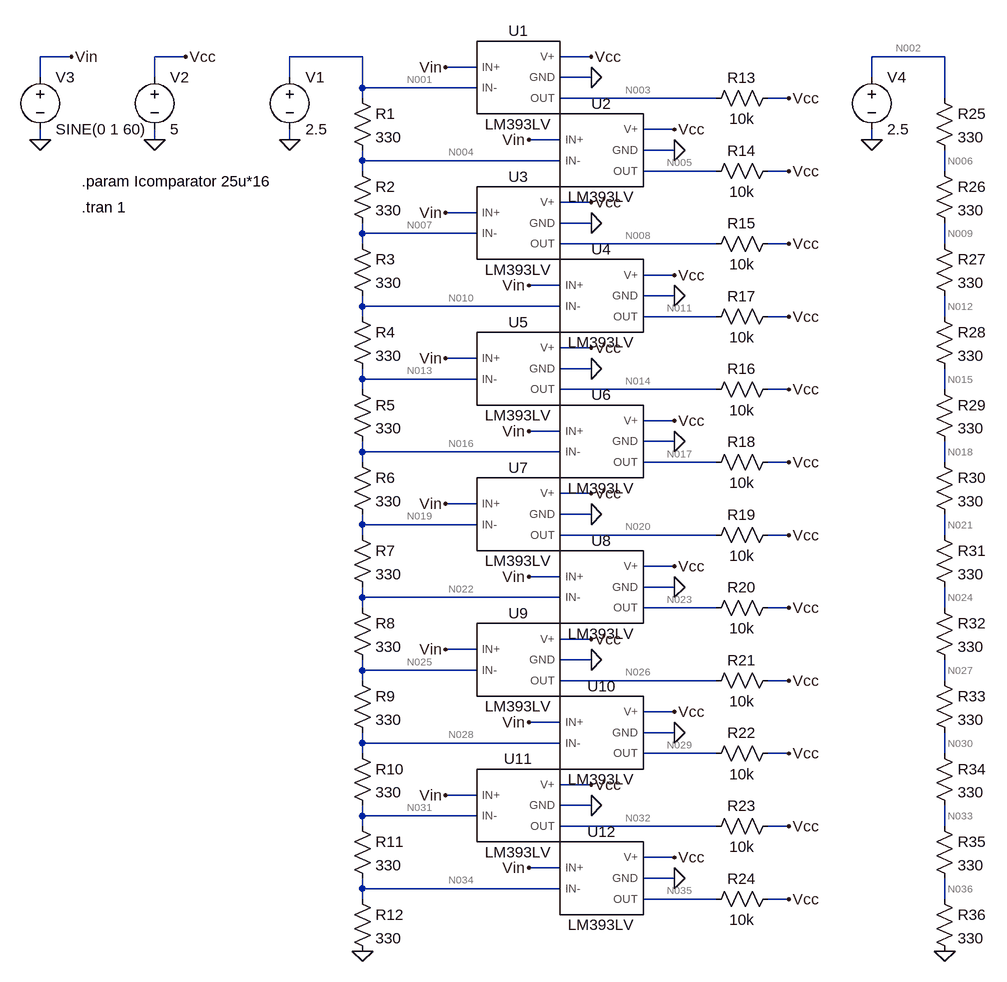
[diagram p0: schematic Draft1.asc]
Draft1.asc, the LTspice schematic file:
Version 4
SHEET 1 1140 1428
WIRE -272 32 -320 32
WIRE -96 32 -144 32
WIRE 176 32 64 32
WIRE 528 32 480 32
WIRE 1072 32 960 32
WIRE 352 48 304 48
WIRE -320 64 -320 32
WIRE -144 64 -144 32
WIRE 64 64 64 32
WIRE 528 64 480 64
WIRE 960 64 960 32
WIRE 176 80 176 32
WIRE 352 80 176 80
WIRE 176 96 176 80
WIRE 720 96 480 96
WIRE 832 96 800 96
WIRE 1072 96 1072 32
WIRE 656 144 608 144
WIRE -320 160 -320 144
WIRE -144 160 -144 144
WIRE 64 160 64 144
WIRE 480 160 432 160
WIRE 960 160 960 144
WIRE 656 176 608 176
WIRE 176 192 176 176
WIRE 480 192 176 192
WIRE 176 208 176 192
WIRE 720 208 608 208
WIRE 832 208 800 208
WIRE 1072 208 1072 176
WIRE 528 256 480 256
WIRE 352 272 304 272
WIRE 528 288 480 288
WIRE 176 304 176 288
WIRE 352 304 176 304
WIRE 176 320 176 304
WIRE 720 320 480 320
WIRE 832 320 800 320
WIRE 1072 320 1072 288
WIRE 656 368 608 368
WIRE 480 384 432 384
WIRE 656 400 608 400
WIRE 176 416 176 400
WIRE 480 416 176 416
WIRE 176 432 176 416
WIRE 720 432 608 432
WIRE 832 432 800 432
WIRE 1072 432 1072 400
WIRE 528 480 480 480
WIRE 352 496 304 496
WIRE 528 512 480 512
WIRE 176 528 176 512
WIRE 352 528 176 528
WIRE 176 544 176 528
WIRE 720 544 480 544
WIRE 832 544 800 544
WIRE 1072 544 1072 512
WIRE 656 592 608 592
WIRE 480 608 432 608
WIRE 656 624 608 624
WIRE 176 640 176 624
WIRE 480 640 176 640
WIRE 176 656 176 640
WIRE 720 656 608 656
WIRE 832 656 800 656
WIRE 1072 656 1072 624
WIRE 528 704 480 704
WIRE 352 720 304 720
WIRE 528 736 480 736
WIRE 176 752 176 736
WIRE 352 752 176 752
WIRE 176 768 176 752
WIRE 720 768 480 768
WIRE 832 768 800 768
WIRE 1072 768 1072 736
WIRE 656 816 608 816
WIRE 480 832 432 832
WIRE 656 848 608 848
WIRE 176 864 176 848
WIRE 480 864 176 864
WIRE 176 880 176 864
WIRE 720 880 608 880
WIRE 832 880 800 880
WIRE 1072 880 1072 848
WIRE 528 928 480 928
WIRE 352 944 304 944
WIRE 528 960 480 960
WIRE 176 976 176 960
WIRE 352 976 176 976
WIRE 176 992 176 976
WIRE 720 992 480 992
WIRE 832 992 800 992
WIRE 1072 992 1072 960
WIRE 656 1040 608 1040
WIRE 480 1056 432 1056
WIRE 656 1072 608 1072
WIRE 176 1088 176 1072
WIRE 480 1088 176 1088
WIRE 176 1104 176 1088
WIRE 720 1104 608 1104
WIRE 832 1104 800 1104
WIRE 1072 1104 1072 1072
WIRE 528 1152 480 1152
WIRE 352 1168 304 1168
WIRE 528 1184 480 1184
WIRE 176 1200 176 1184
WIRE 352 1200 176 1200
WIRE 176 1216 176 1200
WIRE 720 1216 480 1216
WIRE 832 1216 800 1216
WIRE 1072 1216 1072 1184
WIRE 656 1264 608 1264
WIRE 480 1280 432 1280
WIRE 656 1296 608 1296
WIRE 176 1312 176 1296
WIRE 480 1312 176 1312
WIRE 176 1328 176 1312
WIRE 720 1328 608 1328
WIRE 832 1328 800 1328
WIRE 1072 1328 1072 1296
FLAG 176 1408 0
FLAG 64 160 0
FLAG -96 32 Vcc
FLAG -144 160 0
FLAG 304 48 Vin
FLAG 432 160 Vin
FLAG 304 272 Vin
FLAG 432 384 Vin
FLAG 432 608 Vin
FLAG 432 832 Vin
FLAG 304 496 Vin
FLAG 304 720 Vin
FLAG 304 944 Vin
FLAG 304 1168 Vin
FLAG 432 1056 Vin
FLAG 432 1280 Vin
FLAG -320 160 0
FLAG -272 32 Vin
FLAG 528 32 Vcc
FLAG 528 64 0
FLAG 528 256 Vcc
FLAG 528 288 0
FLAG 656 144 Vcc
FLAG 656 176 0
FLAG 656 368 Vcc
FLAG 656 400 0
FLAG 528 480 Vcc
FLAG 528 512 0
FLAG 528 704 Vcc
FLAG 528 736 0
FLAG 528 928 Vcc
FLAG 528 960 0
FLAG 528 1152 Vcc
FLAG 528 1184 0
FLAG 656 592 Vcc
FLAG 656 624 0
FLAG 656 816 Vcc
FLAG 656 848 0
FLAG 656 1040 Vcc
FLAG 656 1072 0
FLAG 656 1264 Vcc
FLAG 656 1296 0
FLAG 832 96 Vcc
FLAG 832 208 Vcc
FLAG 832 320 Vcc
FLAG 832 544 Vcc
FLAG 832 432 Vcc
FLAG 832 656 Vcc
FLAG 832 768 Vcc
FLAG 832 880 Vcc
FLAG 832 992 Vcc
FLAG 832 1104 Vcc
FLAG 832 1216 Vcc
FLAG 832 1328 Vcc
FLAG 1072 1408 0
FLAG 960 160 0
SYMBOL res 160 80 R0
SYMATTR InstName R1
SYMATTR Value 330
SYMBOL res 160 192 R0
SYMATTR InstName R2
SYMATTR Value 330
SYMBOL res 160 304 R0
SYMATTR InstName R3
SYMATTR Value 330
SYMBOL res 160 416 R0
SYMATTR InstName R4
SYMATTR Value 330
SYMBOL res 160 528 R0
SYMATTR InstName R5
SYMATTR Value 330
SYMBOL res 160 640 R0
SYMATTR InstName R6
SYMATTR Value 330
SYMBOL res 160 752 R0
SYMATTR InstName R7
SYMATTR Value 330
SYMBOL res 160 864 R0
SYMATTR InstName R8
SYMATTR Value 330
SYMBOL res 160 976 R0
SYMATTR InstName R9
SYMATTR Value 330
SYMBOL res 160 1088 R0
SYMATTR InstName R10
SYMATTR Value 330
SYMBOL res 160 1200 R0
SYMATTR InstName R11
SYMATTR Value 330
SYMBOL res 160 1312 R0
SYMATTR InstName R12
SYMATTR Value 330
SYMBOL voltage 64 48 R0
SYMATTR InstName V1
SYMATTR Value 2.5
SYMBOL LM393LV 416 64 R0
SYMATTR InstName U1
SYMBOL LM393LV 544 176 R0
SYMATTR InstName U2
SYMBOL LM393LV 416 288 R0
SYMATTR InstName U3
SYMBOL LM393LV 544 400 R0
SYMATTR InstName U4
SYMBOL LM393LV 416 512 R0
SYMATTR InstName U5
SYMBOL LM393LV 544 624 R0
SYMATTR InstName U6
SYMBOL LM393LV 416 736 R0
SYMATTR InstName U7
SYMBOL LM393LV 544 848 R0
SYMATTR InstName U8
SYMBOL LM393LV 416 960 R0
SYMATTR InstName U9
SYMBOL LM393LV 544 1072 R0
SYMATTR InstName U10
SYMBOL LM393LV 416 1184 R0
SYMATTR InstName U11
SYMBOL LM393LV 544 1296 R0
SYMATTR InstName U12
SYMBOL voltage -144 48 R0
SYMATTR InstName V2
SYMATTR Value 5
SYMBOL voltage -320 48 R0
WINDOW 123 0 0 Left 0
WINDOW 39 0 0 Left 0
SYMATTR InstName V3
SYMATTR Value SINE(0 1 60)
SYMBOL res 816 80 R90
WINDOW 0 0 56 VBottom 2
WINDOW 3 32 56 VTop 2
SYMATTR InstName R13
SYMATTR Value 10k
SYMBOL res 816 192 R90
WINDOW 0 0 56 VBottom 2
WINDOW 3 32 56 VTop 2
SYMATTR InstName R14
SYMATTR Value 10k
SYMBOL res 816 304 R90
WINDOW 0 0 56 VBottom 2
WINDOW 3 32 56 VTop 2
SYMATTR InstName R15
SYMATTR Value 10k
SYMBOL res 816 528 R90
WINDOW 0 0 56 VBottom 2
WINDOW 3 32 56 VTop 2
SYMATTR InstName R16
SYMATTR Value 10k
SYMBOL res 816 416 R90
WINDOW 0 0 56 VBottom 2
WINDOW 3 32 56 VTop 2
SYMATTR InstName R17
SYMATTR Value 10k
SYMBOL res 816 640 R90
WINDOW 0 0 56 VBottom 2
WINDOW 3 32 56 VTop 2
SYMATTR InstName R18
SYMATTR Value 10k
SYMBOL res 816 752 R90
WINDOW 0 0 56 VBottom 2
WINDOW 3 32 56 VTop 2
SYMATTR InstName R19
SYMATTR Value 10k
SYMBOL res 816 864 R90
WINDOW 0 0 56 VBottom 2
WINDOW 3 32 56 VTop 2
SYMATTR InstName R20
SYMATTR Value 10k
SYMBOL res 816 976 R90
WINDOW 0 0 56 VBottom 2
WINDOW 3 32 56 VTop 2
SYMATTR InstName R21
SYMATTR Value 10k
SYMBOL res 816 1088 R90
WINDOW 0 0 56 VBottom 2
WINDOW 3 32 56 VTop 2
SYMATTR InstName R22
SYMATTR Value 10k
SYMBOL res 816 1200 R90
WINDOW 0 0 56 VBottom 2
WINDOW 3 32 56 VTop 2
SYMATTR InstName R23
SYMATTR Value 10k
SYMBOL res 816 1312 R90
WINDOW 0 0 56 VBottom 2
WINDOW 3 32 56 VTop 2
SYMATTR InstName R24
SYMATTR Value 10k
SYMBOL res 1056 80 R0
SYMATTR InstName R25
SYMATTR Value 330
SYMBOL res 1056 192 R0
SYMATTR InstName R26
SYMATTR Value 330
SYMBOL res 1056 304 R0
SYMATTR InstName R27
SYMATTR Value 330
SYMBOL res 1056 416 R0
SYMATTR InstName R28
SYMATTR Value 330
SYMBOL res 1056 528 R0
SYMATTR InstName R29
SYMATTR Value 330
SYMBOL res 1056 640 R0
SYMATTR InstName R30
SYMATTR Value 330
SYMBOL res 1056 752 R0
SYMATTR InstName R31
SYMATTR Value 330
SYMBOL res 1056 864 R0
SYMATTR InstName R32
SYMATTR Value 330
SYMBOL res 1056 976 R0
SYMATTR InstName R33
SYMATTR Value 330
SYMBOL res 1056 1088 R0
SYMATTR InstName R34
SYMATTR Value 330
SYMBOL res 1056 1200 R0
SYMATTR InstName R35
SYMATTR Value 330
SYMBOL res 1056 1312 R0
SYMATTR InstName R36
SYMATTR Value 330
SYMBOL voltage 960 48 R0
SYMATTR InstName V4
SYMATTR Value 2.5
TEXT -256 224 Left 2 !.param Icomparator 25u*16
TEXT -256 264 Left 2 !.tran 1

The netlist it stands for:
* Draft1.asc
R1 N001 N004 330
R2 N004 N007 330
R3 N007 N010 330
R4 N010 N013 330
R5 N013 N016 330
R6 N016 N019 330
R7 N019 N022 330
R8 N022 N025 330
R9 N025 N028 330
R10 N028 N031 330
R11 N031 N034 330
R12 N034 0 330
V1 N001 0 2.5
XU1 Vin N001 Vcc 0 N003 LM393LV  ; pins IN+ IN- V+ GND OUT
XU2 Vin N004 Vcc 0 N005 LM393LV  ; pins IN+ IN- V+ GND OUT
XU3 Vin N007 Vcc 0 N008 LM393LV  ; pins IN+ IN- V+ GND OUT
XU4 Vin N010 Vcc 0 N011 LM393LV  ; pins IN+ IN- V+ GND OUT
XU5 Vin N013 Vcc 0 N014 LM393LV  ; pins IN+ IN- V+ GND OUT
XU6 Vin N016 Vcc 0 N017 LM393LV  ; pins IN+ IN- V+ GND OUT
XU7 Vin N019 Vcc 0 N020 LM393LV  ; pins IN+ IN- V+ GND OUT
XU8 Vin N022 Vcc 0 N023 LM393LV  ; pins IN+ IN- V+ GND OUT
XU9 Vin N025 Vcc 0 N026 LM393LV  ; pins IN+ IN- V+ GND OUT
XU10 Vin N028 Vcc 0 N029 LM393LV  ; pins IN+ IN- V+ GND OUT
XU11 Vin N031 Vcc 0 N032 LM393LV  ; pins IN+ IN- V+ GND OUT
XU12 Vin N034 Vcc 0 N035 LM393LV  ; pins IN+ IN- V+ GND OUT
V2 Vcc 0 5
V3 Vin 0 SINE(0 1 60)
R13 Vcc N003 10k
R14 Vcc N005 10k
R15 Vcc N008 10k
R16 Vcc N014 10k
R17 Vcc N011 10k
R18 Vcc N017 10k
R19 Vcc N020 10k
R20 Vcc N023 10k
R21 Vcc N026 10k
R22 Vcc N029 10k
R23 Vcc N032 10k
R24 Vcc N035 10k
R25 N002 N006 330
R26 N006 N009 330
R27 N009 N012 330
R28 N012 N015 330
R29 N015 N018 330
R30 N018 N021 330
R31 N021 N024 330
R32 N024 N027 330
R33 N027 N030 330
R34 N030 N033 330
R35 N033 N036 330
R36 N036 0 330
V4 N002 0 2.5
.param Icomparator 25u*16
.tran 1
.lib C:\Users\alfaw\Documents\LTspice\Spectrum Analyzer\snom697a\lm393lv.lib
.backanno
.end

* Results of the author's LTspice run, read from the files saved beside the schematic
* Operating Point, zero values left out:
*   V(n001) = 2.5 V
*   V(n004) = 2.292 V
*   V(n007) = 2.083 V
*   V(n010) = 1.875 V
*   V(n013) = 1.667 V
*   V(n016) = 1.458 V
*   V(n019) = 1.25 V
*   V(n022) = 1.042 V
*   V(n025) = 833.3 mV
*   V(n028) = 625 mV
*   V(n031) = 416.7 mV
*   V(n034) = 208.3 mV
*   V(vcc) = 5 V
*   V(n003) = 30.81 mV
*   V(n005) = 30.81 mV
*   V(n008) = 30.81 mV
*   V(n011) = 30.81 mV
*   V(n014) = 30.81 mV
*   V(n017) = 30.81 mV
*   V(n020) = 30.81 mV
*   V(n023) = 30.81 mV
*   V(n026) = 30.81 mV
*   V(n029) = 30.81 mV
*   V(n032) = 30.81 mV
*   V(n035) = 30.81 mV
*   V(n002) = 2.5 V
*   V(n006) = 2.292 V
*   V(n009) = 2.083 V
*   V(n012) = 1.875 V
*   V(n015) = 1.667 V
*   V(n018) = 1.458 V
*   V(n021) = 1.25 V
*   V(n024) = 1.042 V
*   V(n027) = 833.3 mV
*   V(n030) = 625 mV
*   V(n033) = 416.7 mV
*   V(n036) = 208.3 mV
*   I(R1) = 631.3 µA
*   I(R2) = 631.3 µA
*   I(R3) = 631.3 µA
*   I(R4) = 631.3 µA
*   I(R5) = 631.3 µA
*   I(R6) = 631.3 µA
*   I(R7) = 631.3 µA
*   I(R8) = 631.3 µA
*   I(R9) = 631.3 µA
*   I(R10) = 631.3 µA
*   I(R11) = 631.3 µA
*   I(R12) = 631.3 µA
*   I(R13) = 496.9 µA
*   I(R14) = 496.9 µA
*   I(R15) = 496.9 µA
*   I(R16) = 496.9 µA
*   I(R17) = 496.9 µA
*   I(R18) = 496.9 µA
*   I(R19) = 496.9 µA
*   I(R20) = 496.9 µA
*   I(R21) = 496.9 µA
*   I(R22) = 496.9 µA
*   I(R23) = 496.9 µA
*   I(R24) = 496.9 µA
*   I(R25) = 631.3 µA
*   I(R26) = 631.3 µA
*   I(R27) = 631.3 µA
*   I(R28) = 631.3 µA
*   I(R29) = 631.3 µA
*   I(R30) = 631.3 µA
*   I(R31) = 631.3 µA
*   I(R32) = 631.3 µA
*   I(R33) = 631.3 µA
*   I(R34) = 631.3 µA
*   I(R35) = 631.3 µA
*   I(R36) = 631.3 µA
*   I(V1) = -631.3 µA
*   I(V2) = -6.263 mA
*   I(V3) = -60 pA
*   I(V4) = -631.3 µA